# Altium schematic sheet SRAM_Module.SCHDOC
size B; SheetNumber: 2; SheetTotal: 7
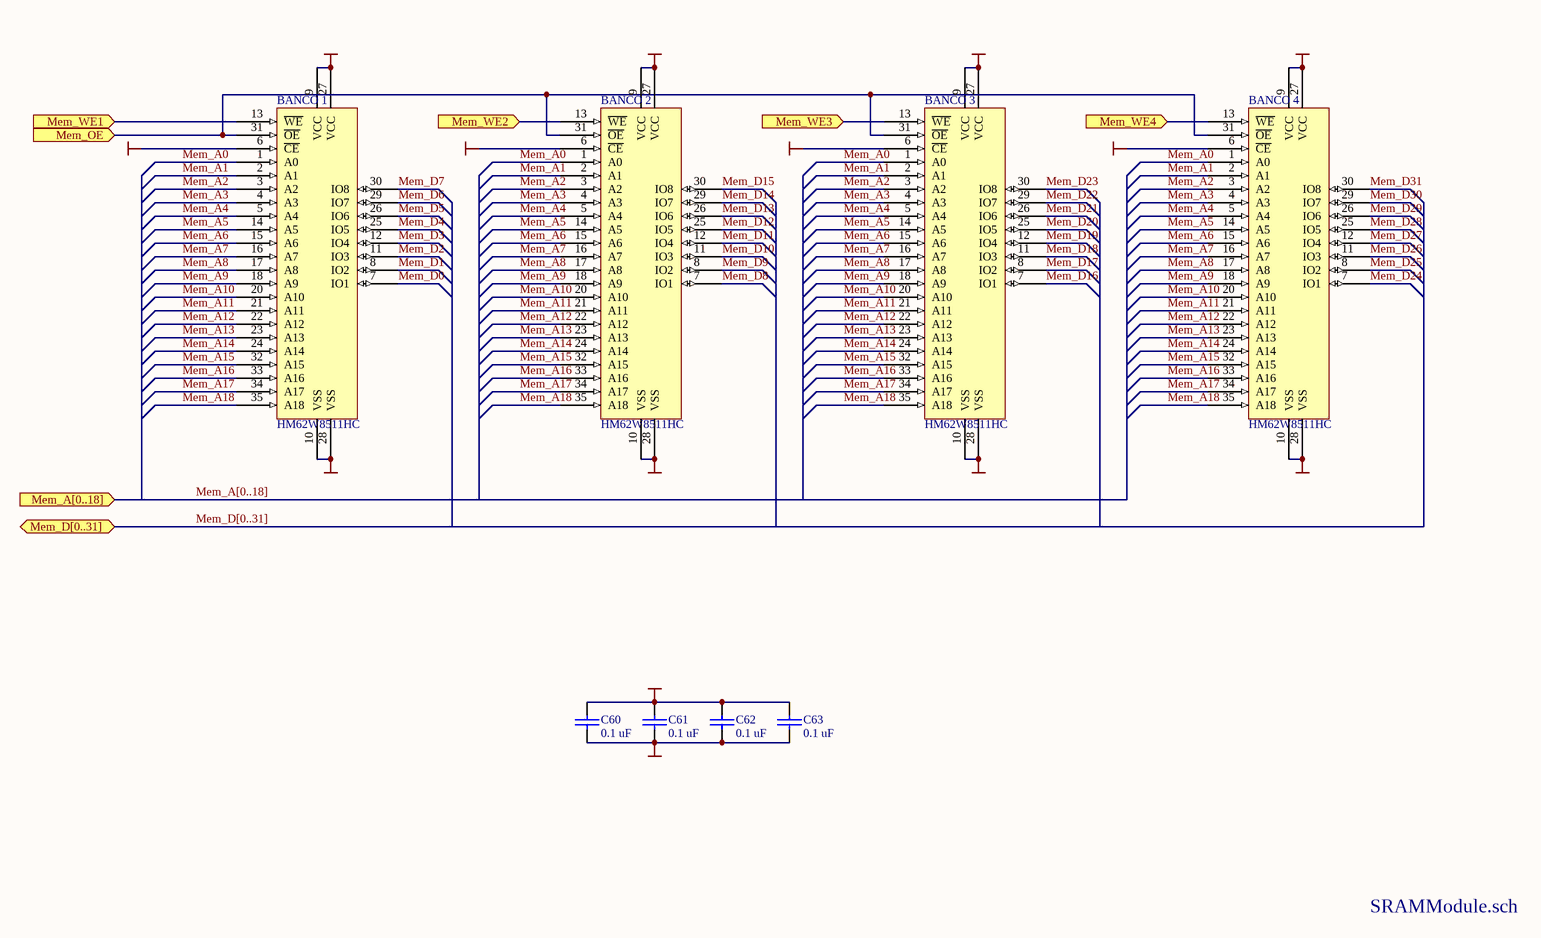
[diagram p0: SRAM_Module.SCHDOC]

## Parts
BANCO_1  HM62W8511HC  [SOJ36/400]
BANCO_2  HM62W8511HC  [SOJ36/400]
BANCO_3  HM62W8511HC  [SOJ36/400]
BANCO_4  HM62W8511HC  [SOJ36/400]
C60  0.1 uF  [CAP 10]
C61  0.1 uF  [CAP 10]
C62  0.1 uF  [CAP 10]
C63  0.1 uF  [CAP 10]

## Ports
Mem_A[0..18] (in), Mem_D[0..31] (bidir), Mem_OE (in), Mem_WE1 (in), Mem_WE2 (in), Mem_WE3 (in), Mem_WE4 (in)

## Nets
GND: BANCO_1.6(~{CE}) BANCO_1.10(VSS) BANCO_1.28(VSS) BANCO_2.6(~{CE}) BANCO_2.10(VSS) BANCO_2.28(VSS) BANCO_3.6(~{CE}) BANCO_3.10(VSS) BANCO_3.28(VSS) BANCO_4.6(~{CE}) BANCO_4.10(VSS) BANCO_4.28(VSS) C60.2 C61.2 C62.2 C63.2  [also labelled VSS]
VCC: BANCO_1.9(VCC) BANCO_1.27(VCC) BANCO_2.9(VCC) BANCO_2.27(VCC) BANCO_3.9(VCC) BANCO_3.27(VCC) BANCO_4.9(VCC) BANCO_4.27(VCC) C60.1 C61.1 C62.1 C63.1  [also labelled VCC_3.3V]
Mem_A0: BANCO_1.1(A0) BANCO_2.1(A0) BANCO_3.1(A0) BANCO_4.1(A0)
Mem_A1: BANCO_1.2(A1) BANCO_2.2(A1) BANCO_3.2(A1) BANCO_4.2(A1)
Mem_A2: BANCO_1.3(A2) BANCO_2.3(A2) BANCO_3.3(A2) BANCO_4.3(A2)
Mem_A3: BANCO_1.4(A3) BANCO_2.4(A3) BANCO_3.4(A3) BANCO_4.4(A3)
Mem_A4: BANCO_1.5(A4) BANCO_2.5(A4) BANCO_3.5(A4) BANCO_4.5(A4)
Mem_A5: BANCO_1.14(A5) BANCO_2.14(A5) BANCO_3.14(A5) BANCO_4.14(A5)
Mem_A6: BANCO_1.15(A6) BANCO_2.15(A6) BANCO_3.15(A6) BANCO_4.15(A6)
Mem_A7: BANCO_1.16(A7) BANCO_2.16(A7) BANCO_3.16(A7) BANCO_4.16(A7)
Mem_A8: BANCO_1.17(A8) BANCO_2.17(A8) BANCO_3.17(A8) BANCO_4.17(A8)
Mem_A9: BANCO_1.18(A9) BANCO_2.18(A9) BANCO_3.18(A9) BANCO_4.18(A9)
Mem_A10: BANCO_1.20(A10) BANCO_2.20(A10) BANCO_3.20(A10) BANCO_4.20(A10)
Mem_A11: BANCO_1.21(A11) BANCO_2.21(A11) BANCO_3.21(A11) BANCO_4.21(A11)
Mem_A12: BANCO_1.22(A12) BANCO_2.22(A12) BANCO_3.22(A12) BANCO_4.22(A12)
Mem_A13: BANCO_1.23(A13) BANCO_2.23(A13) BANCO_3.23(A13) BANCO_4.23(A13)
Mem_A14: BANCO_1.24(A14) BANCO_2.24(A14) BANCO_3.24(A14) BANCO_4.24(A14)
Mem_A15: BANCO_1.32(A15) BANCO_2.32(A15) BANCO_3.32(A15) BANCO_4.32(A15)
Mem_A16: BANCO_1.33(A16) BANCO_2.33(A16) BANCO_3.33(A16) BANCO_4.33(A16)
Mem_A17: BANCO_1.34(A17) BANCO_2.34(A17) BANCO_3.34(A17) BANCO_4.34(A17)
Mem_A18: BANCO_1.35(A18) BANCO_2.35(A18) BANCO_3.35(A18) BANCO_4.35(A18)
Mem_D0: BANCO_1.7(IO1)
Mem_D1: BANCO_1.8(IO2)
Mem_D2: BANCO_1.11(IO3)
Mem_D3: BANCO_1.12(IO4)
Mem_D4: BANCO_1.25(IO5)
Mem_D5: BANCO_1.26(IO6)
Mem_D6: BANCO_1.29(IO7)
Mem_D7: BANCO_1.30(IO8)
Mem_D8: BANCO_2.7(IO1)
Mem_D9: BANCO_2.8(IO2)
Mem_D10: BANCO_2.11(IO3)
Mem_D11: BANCO_2.12(IO4)
Mem_D12: BANCO_2.25(IO5)
Mem_D13: BANCO_2.26(IO6)
Mem_D14: BANCO_2.29(IO7)
Mem_D15: BANCO_2.30(IO8)
Mem_D16: BANCO_3.7(IO1)
Mem_D17: BANCO_3.8(IO2)
Mem_D18: BANCO_3.11(IO3)
Mem_D19: BANCO_3.12(IO4)
Mem_D20: BANCO_3.25(IO5)
Mem_D21: BANCO_3.26(IO6)
Mem_D22: BANCO_3.29(IO7)
Mem_D23: BANCO_3.30(IO8)
Mem_D24: BANCO_4.7(IO1)
Mem_D25: BANCO_4.8(IO2)
Mem_D26: BANCO_4.11(IO3)
Mem_D27: BANCO_4.12(IO4)
Mem_D28: BANCO_4.25(IO5)
Mem_D29: BANCO_4.26(IO6)
Mem_D30: BANCO_4.29(IO7)
Mem_D31: BANCO_4.30(IO8)
Mem_OE: BANCO_1.31(~{OE}) BANCO_2.31(~{OE}) BANCO_3.31(~{OE}) BANCO_4.31(~{OE}) ; port Mem_OE
Mem_WE1: BANCO_1.13(~{WE}) ; port Mem_WE1
Mem_WE2: BANCO_2.13(~{WE}) ; port Mem_WE2
Mem_WE3: BANCO_3.13(~{WE}) ; port Mem_WE3
Mem_WE4: BANCO_4.13(~{WE}) ; port Mem_WE4

## Buses and harness runs
bus Mem_A[0..18] = port Mem_A[0..18]
bus Mem_D[0..31] = port Mem_D[0..31]

## Notes on the sheet
- SRAMModule.sch

## Library data of the parts
C60-C63 = CAP: Capacitor